# EAGLE design RGB (EAGLE 9.5.0)
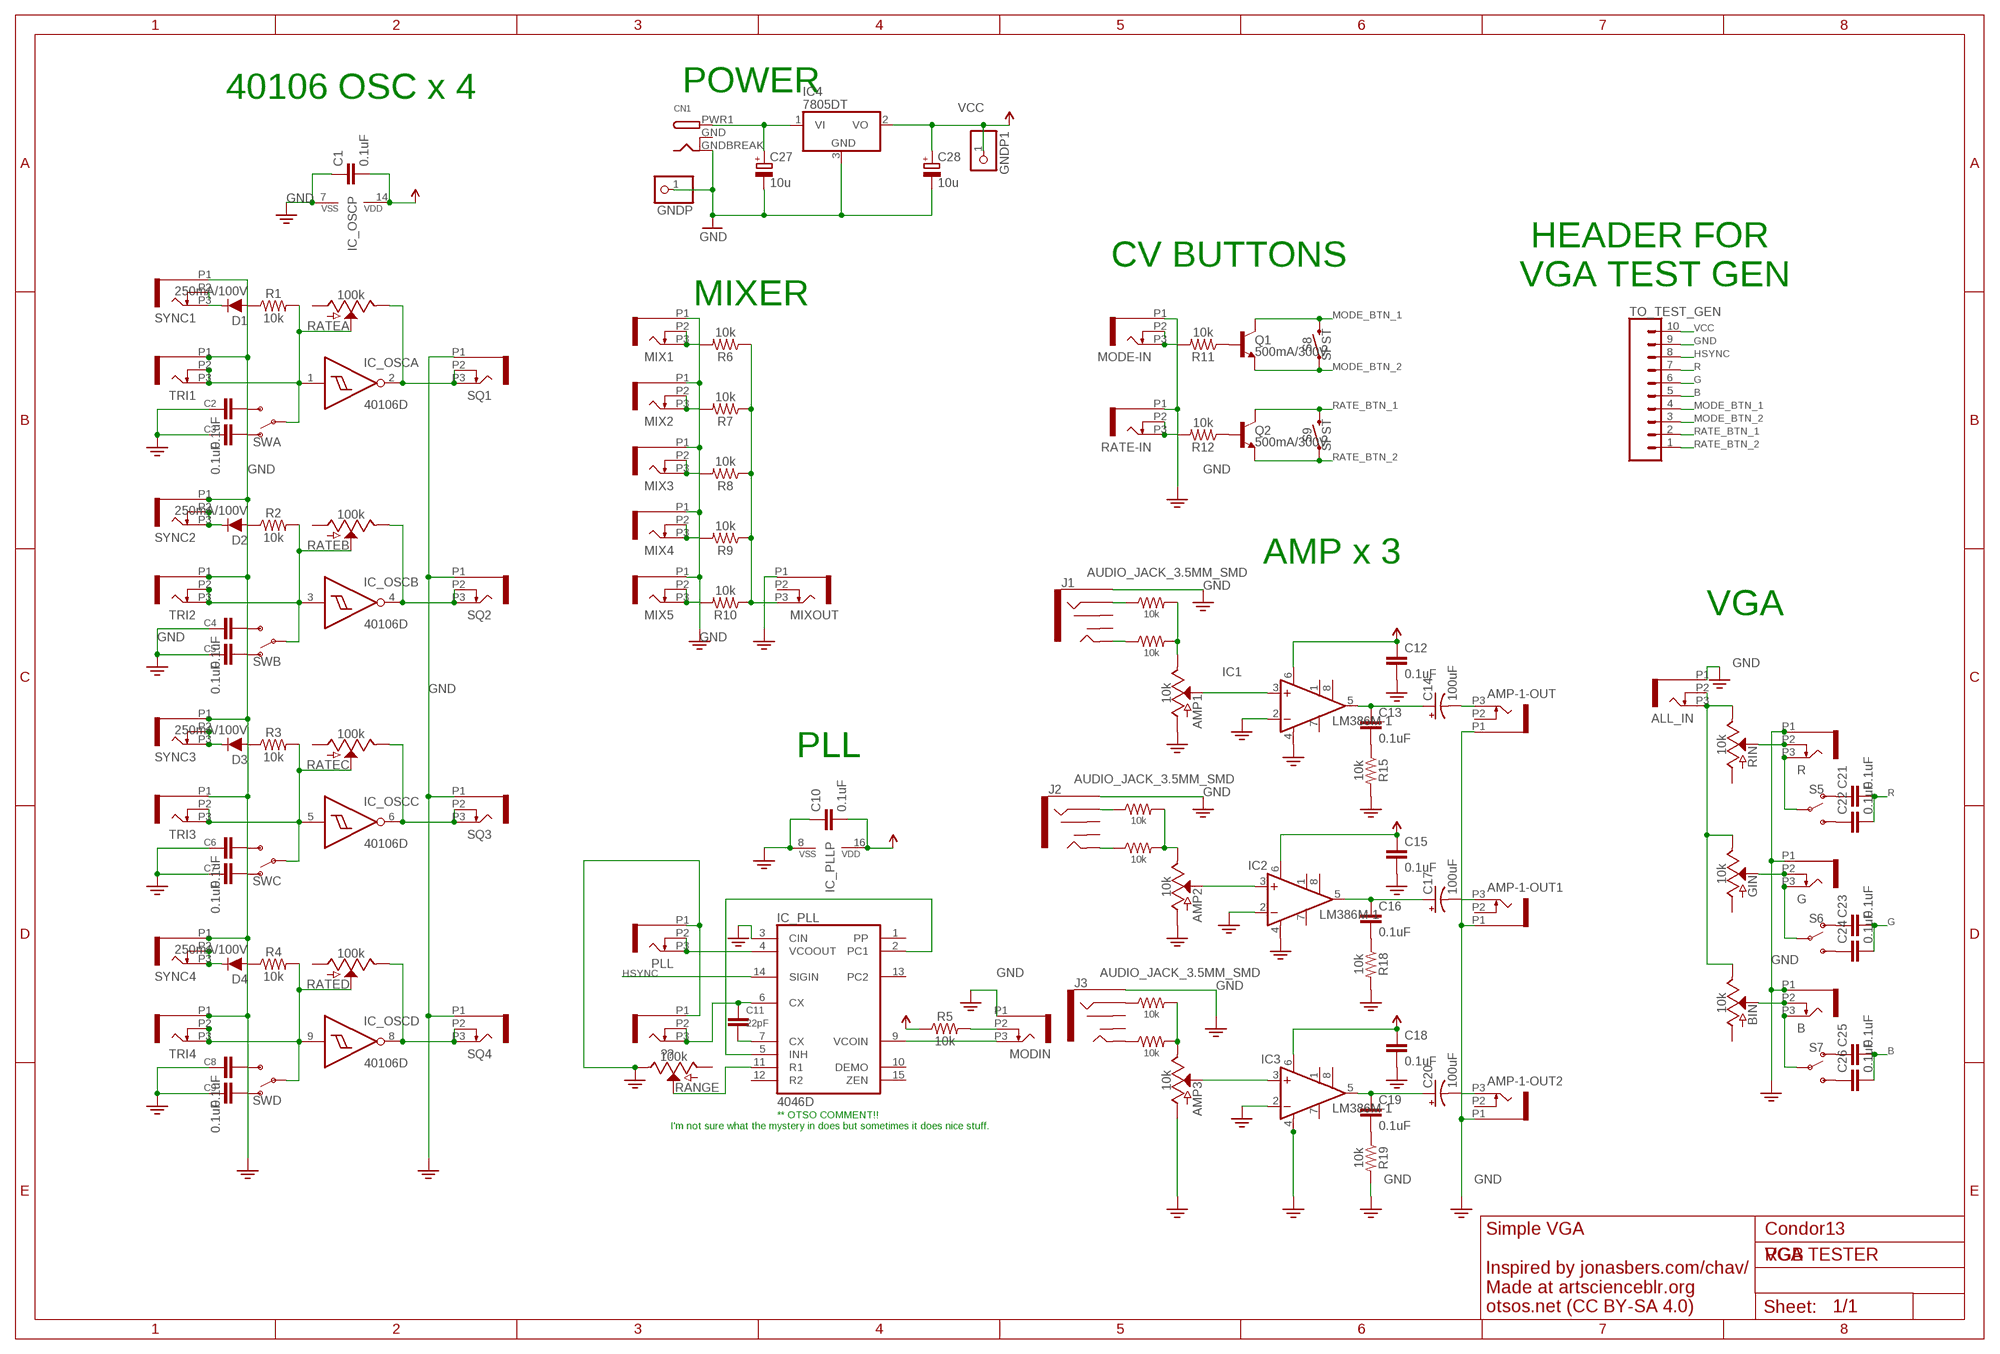
[diagram p0: schematic, sheet 1]

## Parts
??  PJ301_THONKICONN6  [WQP_PJ_301M6]
ALL_IN  PJ301_THONKICONN6  [WQP_PJ_301M6]
AMP1  10k  POTENTIOMETER-PTH-9MM-1/20W-20%-KIT  [POT-PTH-ALPS-KIT]
AMP2  10k  POTENTIOMETER-PTH-9MM-1/20W-20%-KIT  [POT-PTH-ALPS-KIT]
AMP3  10k  POTENTIOMETER-PTH-9MM-1/20W-20%-KIT  [POT-PTH-ALPS-KIT]
AMP-1-OUT  PJ301_THONKICONN6  [WQP_PJ_301M6]
AMP-1-OUT1  PJ301_THONKICONN6  [WQP_PJ_301M6]
AMP-1-OUT2  PJ301_THONKICONN6  [WQP_PJ_301M6]
B  PJ301_THONKICONN6  [WQP_PJ_301M6]
BIN  10k  POTENTIOMETER-PTH-9MM-1/20W-20%-KIT  [POT-PTH-ALPS-KIT]
C1  0.1uF  0.1UF-0603-25V-5%  [0603]
C2  0.1uF  0.1UF-0603-25V-5%  [0603]
C3  0.1uF  0.1UF-0603-25V-5%  [0603]
C4  0.1uF  0.1UF-0603-25V-5%  [0603]
C5  0.1uF  0.1UF-0603-25V-5%  [0603]
C6  0.1uF  0.1UF-0603-25V-5%  [0603]
C7  0.1uF  0.1UF-0603-25V-5%  [0603]
C8  0.1uF  0.1UF-0603-25V-5%  [0603]
C9  0.1uF  0.1UF-0603-25V-5%  [0603]
C10  0.1uF  0.1UF-0603-25V-5%  [0603]
C11  22pF  22PF-0603-50V-5%  [0603]
C12  0.1uF  0.1UF-0603-25V-5%  [0603]
C13  0.1uF  0.1UF-0603-25V-5%  [0603]
C14  100uF  100UF-POLAR-25V-20%(ELEC)  [PANASONIC_D]
C15  0.1uF  0.1UF-0603-25V-5%  [0603]
C16  0.1uF  0.1UF-0603-25V-5%  [0603]
C17  100uF  100UF-POLAR-25V-20%(ELEC)  [PANASONIC_D]
C18  0.1uF  0.1UF-0603-25V-5%  [0603]
C19  0.1uF  0.1UF-0603-25V-5%  [0603]
C20  100uF  100UF-POLAR-25V-20%(ELEC)  [PANASONIC_D]
C21  0.1uF  0.1UF-0603-25V-5%  [0603]
C22  0.1uF  0.1UF-0603-25V-5%  [0603]
C23  0.1uF  0.1UF-0603-25V-5%  [0603]
C24  0.1uF  0.1UF-0603-25V-5%  [0603]
C25  0.1uF  0.1UF-0603-25V-5%  [0603]
C26  0.1uF  0.1UF-0603-25V-5%  [0603]
C27  10u  CPOL-EUD  [PANASONIC_D]
C28  10u  CPOL-EUD  [PANASONIC_D]
CN1  DCBARRELSMT  [DCJACK_2MM_SMT]
D1  250mA/100V  DIODE-BAS16J  [SOD-323]
D2  250mA/100V  DIODE-BAS16J  [SOD-323]
D3  250mA/100V  DIODE-BAS16J  [SOD-323]
D4  250mA/100V  DIODE-BAS16J  [SOD-323]
G  PJ301_THONKICONN6  [WQP_PJ_301M6]
GIN  10k  POTENTIOMETER-PTH-9MM-1/20W-20%-KIT  [POT-PTH-ALPS-KIT]
GNDP  PINHD-1X1CB  [1X01-CLEANBIG]
GNDP1  PINHD-1X1CB  [1X01-CLEANBIG]
IC1  LM386M-1  [SO08]
IC2  LM386M-1  [SO08]
IC3  LM386M-1  [SO08]
IC4  7805DT  [TO252]
IC_OSC  40106D  [SO14]
IC_PLL  4046D  [SO16]
J1  AUDIO_JACK_3.5MM_SMD  [AUDIO-JACK-3.5MM-SMD]
J2  AUDIO_JACK_3.5MM_SMD  [AUDIO-JACK-3.5MM-SMD]
J3  AUDIO_JACK_3.5MM_SMD  [AUDIO-JACK-3.5MM-SMD]
MIX1  PJ301_THONKICONN6  [WQP_PJ_301M6]
MIX2  PJ301_THONKICONN6  [WQP_PJ_301M6]
MIX3  PJ301_THONKICONN6  [WQP_PJ_301M6]
MIX4  PJ301_THONKICONN6  [WQP_PJ_301M6]
MIX5  PJ301_THONKICONN6  [WQP_PJ_301M6]
MIXOUT  PJ301_THONKICONN6  [WQP_PJ_301M6]
MODE-IN  PJ301_THONKICONN6  [WQP_PJ_301M6]
MODIN  PJ301_THONKICONN6  [WQP_PJ_301M6]
PLL  PJ301_THONKICONN6  [WQP_PJ_301M6]
Q1  500mA/300V  TRANS_NPN-MMBTA42  [SOT23-3]
Q2  500mA/300V  TRANS_NPN-MMBTA42  [SOT23-3]
R  PJ301_THONKICONN6  [WQP_PJ_301M6]
R1  10k  10KOHM-0603-1/10W-1%  [0603]
R2  10k  10KOHM-0603-1/10W-1%  [0603]
R3  10k  10KOHM-0603-1/10W-1%  [0603]
R4  10k  10KOHM-0603-1/10W-1%  [0603]
R5  10k  10KOHM-0603-1/10W-1%  [0603]
R6  10k  10KOHM-0603-1/10W-1%  [0603]
R7  10k  10KOHM-0603-1/10W-1%  [0603]
R8  10k  10KOHM-0603-1/10W-1%  [0603]
R9  10k  10KOHM-0603-1/10W-1%  [0603]
R10  10k  10KOHM-0603-1/10W-1%  [0603]
R11  10k  10KOHM-0603-1/10W-1%  [0603]
R12  10k  10KOHM-0603-1/10W-1%  [0603]
R13  10k  10KOHM-0603-1/10W-1%  [0603]
R14  10k  10KOHM-0603-1/10W-1%  [0603]
R15  10k  10KOHM-0603-1/10W-1%  [0603]
R16  10k  10KOHM-0603-1/10W-1%  [0603]
R17  10k  10KOHM-0603-1/10W-1%  [0603]
R18  10k  10KOHM-0603-1/10W-1%  [0603]
R19  10k  10KOHM-0603-1/10W-1%  [0603]
R20  10k  10KOHM-0603-1/10W-1%  [0603]
R21  10k  10KOHM-0603-1/10W-1%  [0603]
RANGE  100k  POTENTIOMETER-PTH-9MM-1/20W-20%-KIT  [POT-PTH-ALPS-KIT]
RATE-IN  PJ301_THONKICONN6  [WQP_PJ_301M6]
RATEA  100k  POTENTIOMETER-PTH-9MM-1/20W-20%-KIT  [POT-PTH-ALPS-KIT]
RATEB  100k  POTENTIOMETER-PTH-9MM-1/20W-20%-KIT  [POT-PTH-ALPS-KIT]
RATEC  100k  POTENTIOMETER-PTH-9MM-1/20W-20%-KIT  [POT-PTH-ALPS-KIT]
RATED  100k  POTENTIOMETER-PTH-9MM-1/20W-20%-KIT  [POT-PTH-ALPS-KIT]
RIN  10k  POTENTIOMETER-PTH-9MM-1/20W-20%-KIT  [POT-PTH-ALPS-KIT]
S5  SWITCH-SPDT-PTH-11.6X4.0MM-LOCK  [SWITCH_SPDT_PTH_11.6X4.0MM_LOCK]
S6  SWITCH-SPDT-PTH-11.6X4.0MM-LOCK  [SWITCH_SPDT_PTH_11.6X4.0MM_LOCK]
S7  SWITCH-SPDT-PTH-11.6X4.0MM-LOCK  [SWITCH_SPDT_PTH_11.6X4.0MM_LOCK]
S8  SPST  MOMENTARY-SWITCH-SPST-SMD-6.2MM-TALL  [TACTILE_SWITCH_SMD_6.2MM_TALL]
S9  SPST  MOMENTARY-SWITCH-SPST-SMD-6.2MM-TALL  [TACTILE_SWITCH_SMD_6.2MM_TALL]
SQ1  PJ301_THONKICONN6  [WQP_PJ_301M6]
SQ2  PJ301_THONKICONN6  [WQP_PJ_301M6]
SQ3  PJ301_THONKICONN6  [WQP_PJ_301M6]
SQ4  PJ301_THONKICONN6  [WQP_PJ_301M6]
SWA  SWITCH-SPDT-PTH-11.6X4.0MM-LOCK  [SWITCH_SPDT_PTH_11.6X4.0MM_LOCK]
SWB  SWITCH-SPDT-PTH-11.6X4.0MM-LOCK  [SWITCH_SPDT_PTH_11.6X4.0MM_LOCK]
SWC  SWITCH-SPDT-PTH-11.6X4.0MM-LOCK  [SWITCH_SPDT_PTH_11.6X4.0MM_LOCK]
SWD  SWITCH-SPDT-PTH-11.6X4.0MM-LOCK  [SWITCH_SPDT_PTH_11.6X4.0MM_LOCK]
SYNC1  PJ301_THONKICONN6  [WQP_PJ_301M6]
SYNC2  PJ301_THONKICONN6  [WQP_PJ_301M6]
SYNC3  PJ301_THONKICONN6  [WQP_PJ_301M6]
SYNC4  PJ301_THONKICONN6  [WQP_PJ_301M6]
TO_TEST_GEN  CONN_102MMSMD  [1X10-2MM-SMD]
TRI1  PJ301_THONKICONN6  [WQP_PJ_301M6]
TRI2  PJ301_THONKICONN6  [WQP_PJ_301M6]
TRI3  PJ301_THONKICONN6  [WQP_PJ_301M6]
TRI4  PJ301_THONKICONN6  [WQP_PJ_301M6]

## Nets
3.3V: IC2.4(GND) ; supply symbol labelled GND
B: C25.2 C26.2 TO_TEST_GEN.5
G: C23.2 C24.2 TO_TEST_GEN.6
GND: ??.P1 ALL_IN.P1 AMP1.P$3(A) AMP2.P$3(A) AMP3.P$3(A) AMP-1-OUT1.P1 AMP-1-OUT2.P1 AMP-1-OUT.P1 B.P1 C1.1 C2.2 C3.2 C4.2 C5.2 C6.2 C7.2 C8.2 C9.2 C10.1 C12.2 C15.2 C18.2 C27.- C28.- CN1.GNDBREAK(GND) G.P1 GNDP.1 IC1.2(-IN) IC1.4(GND) IC2.2(-IN) IC3.2(-IN) IC3.4(GND) IC4.3(GND) IC_OSC.7(P:VSS) IC_PLL.3(CIN) IC_PLL.8(VSS) J1.SLEEVE J2.SLEEVE J3.SLEEVE MIX1.P1 MIX2.P1 MIX3.P1 MIX4.P1 MIX5.P1 MIXOUT.P1 MODE-IN.P1 MODIN.P1 PLL.P1 R15.2 R18.2 R19.2 R.P1 RANGE.P$1(E) RATE-IN.P1 SQ1.P1 SQ2.P1 SQ3.P1 SQ4.P1 SYNC1.P1 SYNC2.P1 SYNC3.P1 SYNC4.P1 TO_TEST_GEN.9 TRI1.P1 TRI2.P1 TRI3.P1 TRI4.P1
HSYNC: IC_PLL.14(SIGIN) TO_TEST_GEN.8
MODE_BTN_1: Q1.3(C) S8.B2 TO_TEST_GEN.4
MODE_BTN_2: Q1.2(E) S8.A2 TO_TEST_GEN.3
N$1: IC_PLL.2(PC1) IC_PLL.5(INH)
N$2: ??.P2 ??.P3 C11.1 IC_PLL.6(CX)
N$3: C11.2 IC_PLL.7(CX)
N$4: MIX1.P2 MIX1.P3 R6.2
N$5: MIX2.P2 MIX2.P3 R7.2
N$6: MIX3.P2 MIX3.P3 R8.2
N$7: MIX4.P2 MIX4.P3 R9.2
N$8: AMP1.P$2(S) IC1.3(+IN)
N$9: C13.2 R15.1
N$10: MIX5.P2 MIX5.P3 R10.2
N$11: MIXOUT.P3 R6.1 R7.1 R8.1 R9.1 R10.1
N$12: C13.1 C14.+ IC1.5(OUT)
N$13: ALL_IN.P3 BIN.P$1(E) GIN.P$1(E) RIN.P$1(E)
N$14: D2.A R2.1
N$15: R.P2 RIN.P$2(S)
N$16: R.P3 S5.2(P)
N$17: IC_OSC.2(A:O) RATEA.P$1(E) SQ1.P2 SQ1.P3
N$18: D2.C SYNC2.P3
N$19: IC_OSC.4(B:O) RATEB.P$1(E) SQ2.P2 SQ2.P3
N$20: SYNC3.P2
N$21: C4.1 SWB.3(S)
N$22: C22.1 S5.3(S)
N$23: C21.1 S5.1(O)
N$24: G.P2 GIN.P$2(S)
N$25: G.P3 S6.2(P)
N$26: C24.1 S6.3(S)
N$27: C23.1 S6.1(O)
N$28: AMP1.P$1(E) R13.2 R14.2
N$29: D1.C SYNC1.P3
N$30: D1.A R1.1
N$31: IC_OSC.1(A:I) R1.2 RATEA.P$2(S) SWA.2(P) TRI1.P2 TRI1.P3
N$32: C2.1 SWA.3(S)
N$33: C3.1 SWA.1(O)
N$34: C5.1 SWB.1(O)
N$35: D3.A R3.1
N$36: D3.C SYNC3.P3
N$37: IC_OSC.6(C:O) RATEC.P$1(E) SQ3.P2 SQ3.P3
N$38: IC_OSC.5(C:I) R3.2 RATEC.P$2(S) SWC.2(P) TRI3.P2 TRI3.P3
N$39: C6.1 SWC.3(S)
N$40: C7.1 SWC.1(O)
N$41: D4.A R4.1
N$42: D4.C SYNC4.P3
N$43: IC_OSC.8(D:O) RATED.P$1(E) SQ4.P2 SQ4.P3
N$44: IC_OSC.9(D:I) R4.2 RATED.P$2(S) SWD.2(P) TRI4.P2 TRI4.P3
N$45: C8.1 SWD.3(S)
N$46: C9.1 SWD.1(O)
N$47: IC_PLL.11(R1) RANGE.P$2(S)
N$48: MODIN.P2 R5.2
N$49: IC_PLL.9(VCOIN) MODIN.P3
N$50: J1.RING R13.1
N$51: J1.TIP R14.1
N$52: AMP-1-OUT.P3 C14.-
N$53: AMP2.P$2(S) IC2.3(+IN)
N$54: C16.2 R18.1
N$55: C16.1 C17.+ IC2.5(OUT)
N$56: J2.RING R16.1
N$57: J2.TIP R17.1
N$58: AMP2.P$1(E) R16.2 R17.2
N$59: AMP-1-OUT1.P3 C17.-
N$60: AMP3.P$2(S) IC3.3(+IN)
N$61: C19.2 R19.1
N$62: C19.1 C20.+ IC3.5(OUT)
N$63: B.P2 BIN.P$2(S)
N$64: B.P3 S7.2(P)
N$65: J3.RING R20.1
N$66: AMP-1-OUT2.P3 C20.-
N$67: C26.1 S7.3(S)
N$68: C25.1 S7.1(O)
N$69: Q1.1(B) R11.1
N$70: MODE-IN.P3 R11.2
N$71: Q2.1(B) R12.1
N$72: R12.2 RATE-IN.P3
N$73: AMP3.P$1(E) R20.2 R21.2
N$74: J3.TIP R21.1
N$75: SYNC4.P2
N$76: SYNC1.P2
N$77: SYNC2.P2
N$78: IC_OSC.3(B:I) R2.2 RATEB.P$2(S) SWB.2(P) TRI2.P2 TRI2.P3
N$79: C27.+ CN1.PWR1(PWR) IC4.1(VI)
N$87: IC_PLL.4(VCOOUT) PLL.P2 PLL.P3
N$88: MODE-IN.P2
N$89: RATE-IN.P2
N$90: ALL_IN.P2
R: C21.2 C22.2 TO_TEST_GEN.7
RATE_BTN_1: Q2.3(C) S9.B2 TO_TEST_GEN.2
RATE_BTN_2: Q2.2(E) S9.A2 TO_TEST_GEN.1
VCC: C1.2 C10.2 C12.1 C15.1 C18.1 C28.+ GNDP1.1 IC1.6(VS) IC2.6(VS) IC3.6(VS) IC4.2(VO) IC_OSC.14(P:VDD) IC_PLL.16(VDD) R5.1 TO_TEST_GEN.10
Unconnected: AMP-1-OUT1.P2 AMP-1-OUT2.P2 AMP-1-OUT.P2 BIN.P$3(A) GIN.P$3(A) IC1.1(GAIN) IC1.7(BYPASS) IC1.8(GAIN) IC2.1(GAIN) IC2.7(BYPASS) IC2.8(GAIN) IC3.1(GAIN) IC3.7(BYPASS) IC3.8(GAIN) IC_OSC.10(E:O) IC_OSC.11(E:I) IC_OSC.12(F:O) IC_OSC.13(F:I) IC_PLL.1(PP) IC_PLL.10(DEMO) IC_PLL.12(R2) IC_PLL.13(PC2) IC_PLL.15(ZEN) J1.RSH J1.TSH J2.RSH J2.TSH J3.RSH J3.TSH MIXOUT.P2 RANGE.P$3(A) RATEA.P$3(A) RATEB.P$3(A) RATEC.P$3(A) RATED.P$3(A) RIN.P$3(A)

## Notes on the sheet
- 40106 OSC x 4
- POWER
- CV BUTTONS
- HEADER FOR 
  VGA TEST GEN
- MIXER
- AMP x 3
- VGA
- PLL
- ** OTSO COMMENT!! 
  I'm not sure what the mystery in does but sometimes it does nice stuff.
- Simple VGA 
  
  Inspired by jonasbers.com/chav/
  Made at artscienceblr.org
  otsos.net (CC BY-SA 4.0)
- Condor13
- VGA TESTER

## Power pins joined to a net without a drawn wire
GNDBREAK: CN1.GND(GNDBREAK)

## Library data of the parts
?? ALL_IN AMP-1-OUT AMP-1-OUT1 AMP-1-OUT2 B G MIX1-MIX5 MIXOUT MODE-IN MODIN PLL R RATE-IN SQ1-SQ4 SYNC1-SYNC4 TRI1-TRI4 = og-pj301:PJ301_THONKICONN
AMP1-AMP3 BIN GIN RIN = SparkFun-Resistors:POTENTIOMETER: Potentiometer (Pot) Three-terminal potentiometers, with an adjustable wiper and two adjustable resistors. A pot can be used to create a configurable voltage divider, or as a variable resistor. Variants ALPS_POT and ALPS_POT_KIT - PTH, breadboard compatible, 9mm square pots Rotary Potentiometer - Linear (10k ohm) <https://www.sparkfun.com/products/9288> (COM-09288) The KIT variant exposes copper on only one side of the PTH pad, so the part can only be assembled on one side of the PCB. Useful for beginner soldering kits.; PROD_ID: RES-09177; SF_SKU: COM-09288
C1-C10 C12 C13 C15 C16 C18 C19 C21-C26 = SparkFun-Capacitors:0.1UF: 0.1µF ceramic capacitors A capacitor is a passive two-terminal electrical component used to store electrical energy temporarily in an electric field.; PROD_ID: CAP-08604
C11 = SparkFun-Capacitors:22PF: 22pF ceramic capacitors A capacitor is a passive two-terminal electrical component used to store electrical energy temporarily in an electric field.; PROD_ID: CAP-07876
C14 C17 C20 = SparkFun-Capacitors:100UF-POLAR: 100µF polarized capacitors A capacitor is a passive two-terminal electrical component used to store electrical energy temporarily in an electric field.; PROD_ID: CAP-12547
C27 C28 = rcl:CPOL-EU: POLARIZED CAPACITOR, European symbol
CN1 = adafruit:DCBARREL: 2.0mm DC Barrel Jack DCJACK_2MM_PTH - Through Hole Jack (4UConnector: 05537)
D1-D4 = SparkFun-DiscreteSemi:DIODE: Diode These are standard reverse protection diodes and small signal diodes. SparkFun Products: SparkFun SparkPunk Sound Kit <https://www.sparkfun.com/products/11177> SparkFun ESP8266 Thing <https://www.sparkfun.com/products/13231>; PROD_ID: DIO-09646
GNDP GNDP1 = adafruit:PINHD-1X1: Pin header 1x1 for 0.1" spacing With round pins
IC1-IC3 = linear:LM386?-*: Low Voltage Audio Power Amplifier Source: http://cache.national.com/ds/LM/LM386.pdf
IC4 = adafruit:78*: Positive VOLTAGE REGULATOR Added bigger pads to the TO-92 package
IC_OSC = 40xx:40106: Hex SCHMITT TRIGGER
IC_PLL = 40xx:4046: Micropower PLL
J1-J3 = SparkFun-Connectors:AUDIO_JACK_3.5MM: Audio Jack 3.5mm variants of PTH and SMT stereo audio jack with bypass switches. SparkFun Products: SparkFun SparkPunk Sound Kit <[https://www.sparkfun.com/products/11177]> - PTH MP3 Trigger <https://www.sparkfun.com/products/13720> -3.5mm SMD SparkFun PicoBoard <https://www.sparkfun.com/products/11888>- 2.5mm SMD; PROD_ID: CONN-10353
Q1 Q2 = SparkFun-DiscreteSemi:TRANS_NPN: NPN transistor Current controlled devices typically used to amplify current or used as a switch. BC547 - COM-08928 <http://www.sparkfun.com/products/8928> (TO-92 45V 100mA) (1.Collector 2.Base 3.Emitter) 2N3904 - COM-00521 <http://www.sparkfun.com/products/521> (TO-92 40V 200mA) (1.Emitter 2.Base 3.Collector) P2N2222A - COM-12852 <http://www.sparkfun.com/products/12852> (TO-92 40V 600mA) (1.Collector 2.Base 3.Emitter); PROD_ID: TRANS-09116
R1-R21 = SparkFun-Resistors:10KOHM: 10kΩ resistor A resistor is a passive two-terminal electrical component that implements electrical resistance as a circuit element. Resistors act to reduce current flow, and, at the same time, act to lower voltage levels within circuits. - Wikipedia; PROD_ID: RES-00824
RANGE RATEA RATEB RATEC RATED = SparkFun-Resistors:POTENTIOMETER: Potentiometer (Pot) Three-terminal potentiometers, with an adjustable wiper and two adjustable resistors. A pot can be used to create a configurable voltage divider, or as a variable resistor. Variants ALPS_POT and ALPS_POT_KIT - PTH, breadboard compatible, 9mm square pots Rotary Potentiometer - Linear (10k ohm) <https://www.sparkfun.com/products/9288> (COM-09288) The KIT variant exposes copper on only one side of the PTH pad, so the part can only be assembled on one side of the PCB. Useful for beginner soldering kits.; PROD_ID: RES-09177; SF_SKU: COM-09288; VALUE: 10k
S5-S7 SWA SWB SWC SWD = SparkFun-Switches:SWITCH-SPDT: Single Pole, Double Throw (SPDT) Switch Single-pole, double-throw (SPDT) switch. Variant Overview SMD-AYZ0202 Surface Mount DPDT Switch <https://www.sparkfun.com/products/597> (COM-00597) Used on e.g. LilyPad Arduino USB - ATmega32U4 Board <https://www.sparkfun.com/products/12049> PTH-11.6X4.0MM SPDT Mini Power Switch <https://www.sparkfun.com/products/102> (COM-00102) Used on e.g. SparkFun Simon Says - Through-Hole Soldering Kit <https://www.sparkfun.com/products/10547> (KIT-10547) PTH-11.6X4.0MM-KIT KIT version of SPDT Mini Power Switch - Simplifies soldering by removing tStop of switch pins - only one side can be soldered. PTH-11.6X4.0MM-LOCK LOCK version of SPDT Mini Power Switch - Offset pins hold switch in place for easier soldering. SMD-RIGHT-ANGLE Surface Mount Right Angle Switch <https://www.sparkfun.com/products/10860> (COM-10860) Used on e.g. SparkFun ESP8266 Thing <https://www.sparkfun.com/products/13231>; PROD_ID: SWCH-08261; SF_SKU: COM-00102
S8 S9 = SparkFun-Switches:MOMENTARY-SWITCH-SPST: Momentary Switch (Pushbutton) - SPST Normally-open (NO) SPST momentary switches (buttons, pushbuttons). Variants PTH-12MM - 12mm square, through-hole Momentary Pushbutton Switch - 12mm Square <https://www.sparkfun.com/products/9190> (COM-09190) PTH-6.0MM, PTH-6.0MM-KIT - 6.0mm square, through-hole Mini Pushbutton Switch <https://www.sparkfun.com/products/97> (COM-00097) KIT package intended for soldering kit's - only one side of pads' copper is exposed. PTH-RIGHT-ANGLE-KIT - Right-angle, through-hole Right Angle Tactile Button <https://www.sparkfun.com/products/10791> - Used on SparkFun BigTime Watch Kit <https://www.sparkfun.com/products/11734> SMD-12MM - 12mm square, surface-mount Tactile Button - SMD (12mm) <https://www.sparkfun.com/products/12993> (COM-12993) Used on SparkFun PicoBoard <https://www.sparkfun.com/products/11888> SMD-4.5MM - 4.5mm Square Trackball Switch Used on SparkFun Blackberry Trackballer Breakout <https://www.sparkfun.com/products/13169> SMD-4.6MMX2.8MM - 4.60mm x 2.80mm, surface mount Used on SparkFun SAMD21 Mini Breakout <https://www.sparkfun.com/products/13664> SMD-5.2MM, SMD-5.2-REDUNDANT - 5.2mm square, surface-mount Mini Pushbutton Switch - SMD <https://www.sparkfun.com/products/8720> (COM-08720) Used on Arduino Pro Mini <https://www.sparkfun.com/products/11114> REDUNDANT package connects both switch circuits together SMD-6.0X3.5MM - 6.0 x 3.5mm, surface mount Momentary Reset Switch SMD <https://www.sparkfun.com/products/8229> (COM-08229) SMD-6.2MM-TALL - 6.2mm square, surface mount Tactile Button - SMD (6mm) <https://www.sparkfun.com/products/12992> Used on SparkFun Digital Sandbox <https://www.sparkfun.com/products/12651> SMD-RIGHT-ANGLE - Right-angle, surface mount Used on SparkFun Block for Intel® Edison - Arduino <https://www.sparkfun.com/products/13036>; PROD_ID: SWCH-11966; SF_SKU: COM-12992
TO_TEST_GEN = SparkFun-Connectors:CONN_10: Multi connection point. Often used as Generic Header-pin footprint for 0.1 inch spaced/style header connections On any of the 0.1 inch spaced packages, you can populate with these: Break Away Headers - Straight <https://www.sparkfun.com/products/116> (PRT-00116) Break Away Male Headers - Right Angle <https://www.sparkfun.com/products/553> (PRT-00553) Female Headers <https://www.sparkfun.com/products/115> (PRT-00115) Break Away Headers - Machine Pin <https://www.sparkfun.com/products/117> (PRT-00117) Break Away Female Headers - Swiss Machine Pin <https://www.sparkfun.com/products/743> (PRT-00743) Arduino Stackable Header - 10 Pin <https://www.sparkfun.com/products/11376> (PRT-11376) For SCREWTERMINALS and SPRING TERMINALS visit here: Screw Terimnals on SparkFun.com <https://www.sparkfun.com/search/results?term=Screw+Terminals> (5mm/3.5mm/2.54mm spacing) This device is also useful as a general connection point to wire up your design to another part of your project. Our various solder wires solder well into these plated through hole pads. Hook-Up Wire - Assortment (Stranded, 22 AWG) <https://www.sparkfun.com/products/11375> (PRT-11375) Hook-Up Wire - Assortment (Solid Core, 22 AWG) <https://www.sparkfun.com/products/11367> (PRT-11367) View the entire wire category on our website here <https://www.sparkfun.com/categories/141> Special notes: Molex polarized connector foot print use with SKU : PRT-08231 with associated crimp pins and housings. 1MM SMD Version SKU: PRT-10208 NOTES ON THE VARIANTS LOCK and LOCK_LONGPADS... This footprint was designed to help hold the alignment of a through-hole component (i.e. 6-pin header) while soldering it into place. You may notice that each hole has been shifted either up or down by 0.005 of an inch from it's more standard position (which is a perfectly straight line). This slight alteration caused the pins (the squares in the middle) to touch the edges of the holes. Because they are alternating, it causes a "brace" to hold the component in place. 0.005 has proven to be the perfect amount of "off-center" position when using our standard breakaway headers. Although looks a little odd when you look at the bare footprint, once you have a header in there, the alteration is very hard to notice. Also,if you push a header all the way into place, it is covered up entirely on the bottom side.; PROD_ID: CONN-09042; SF_ID: PRT-10030

## Board
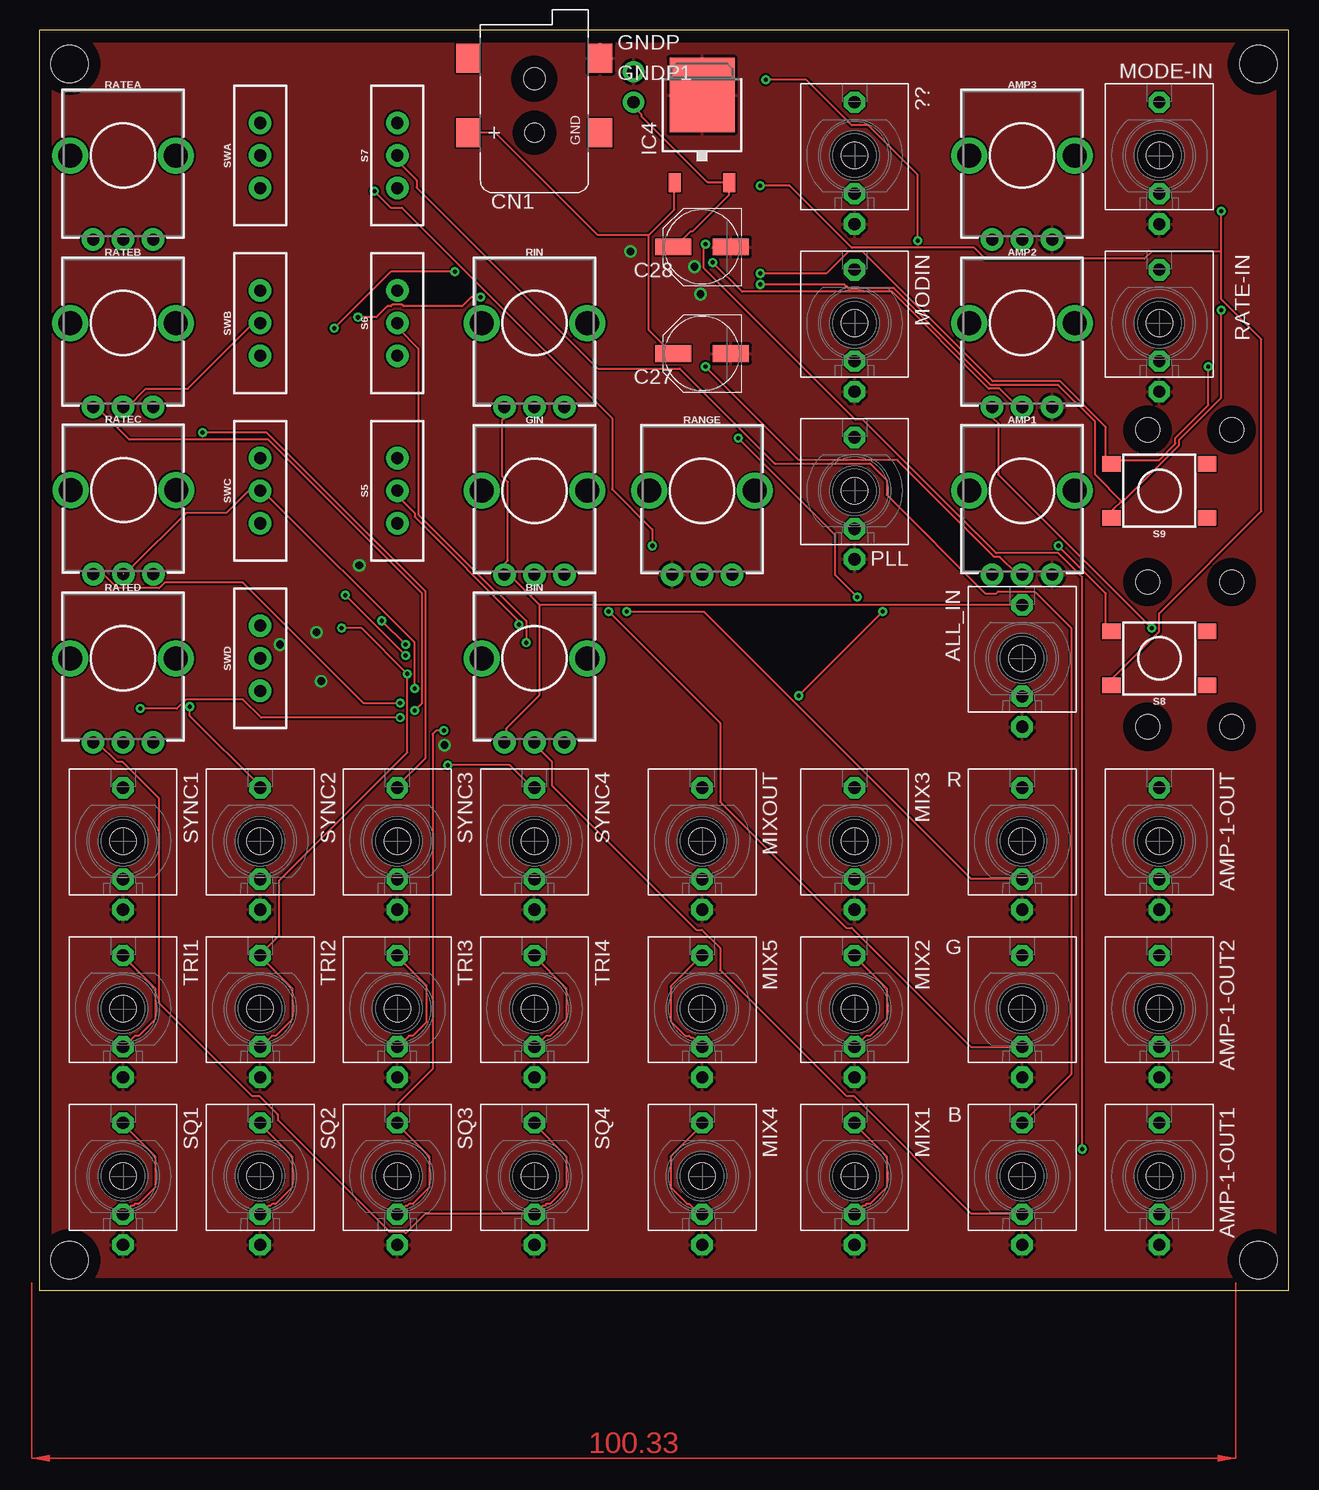
[diagram p1: board, top side]
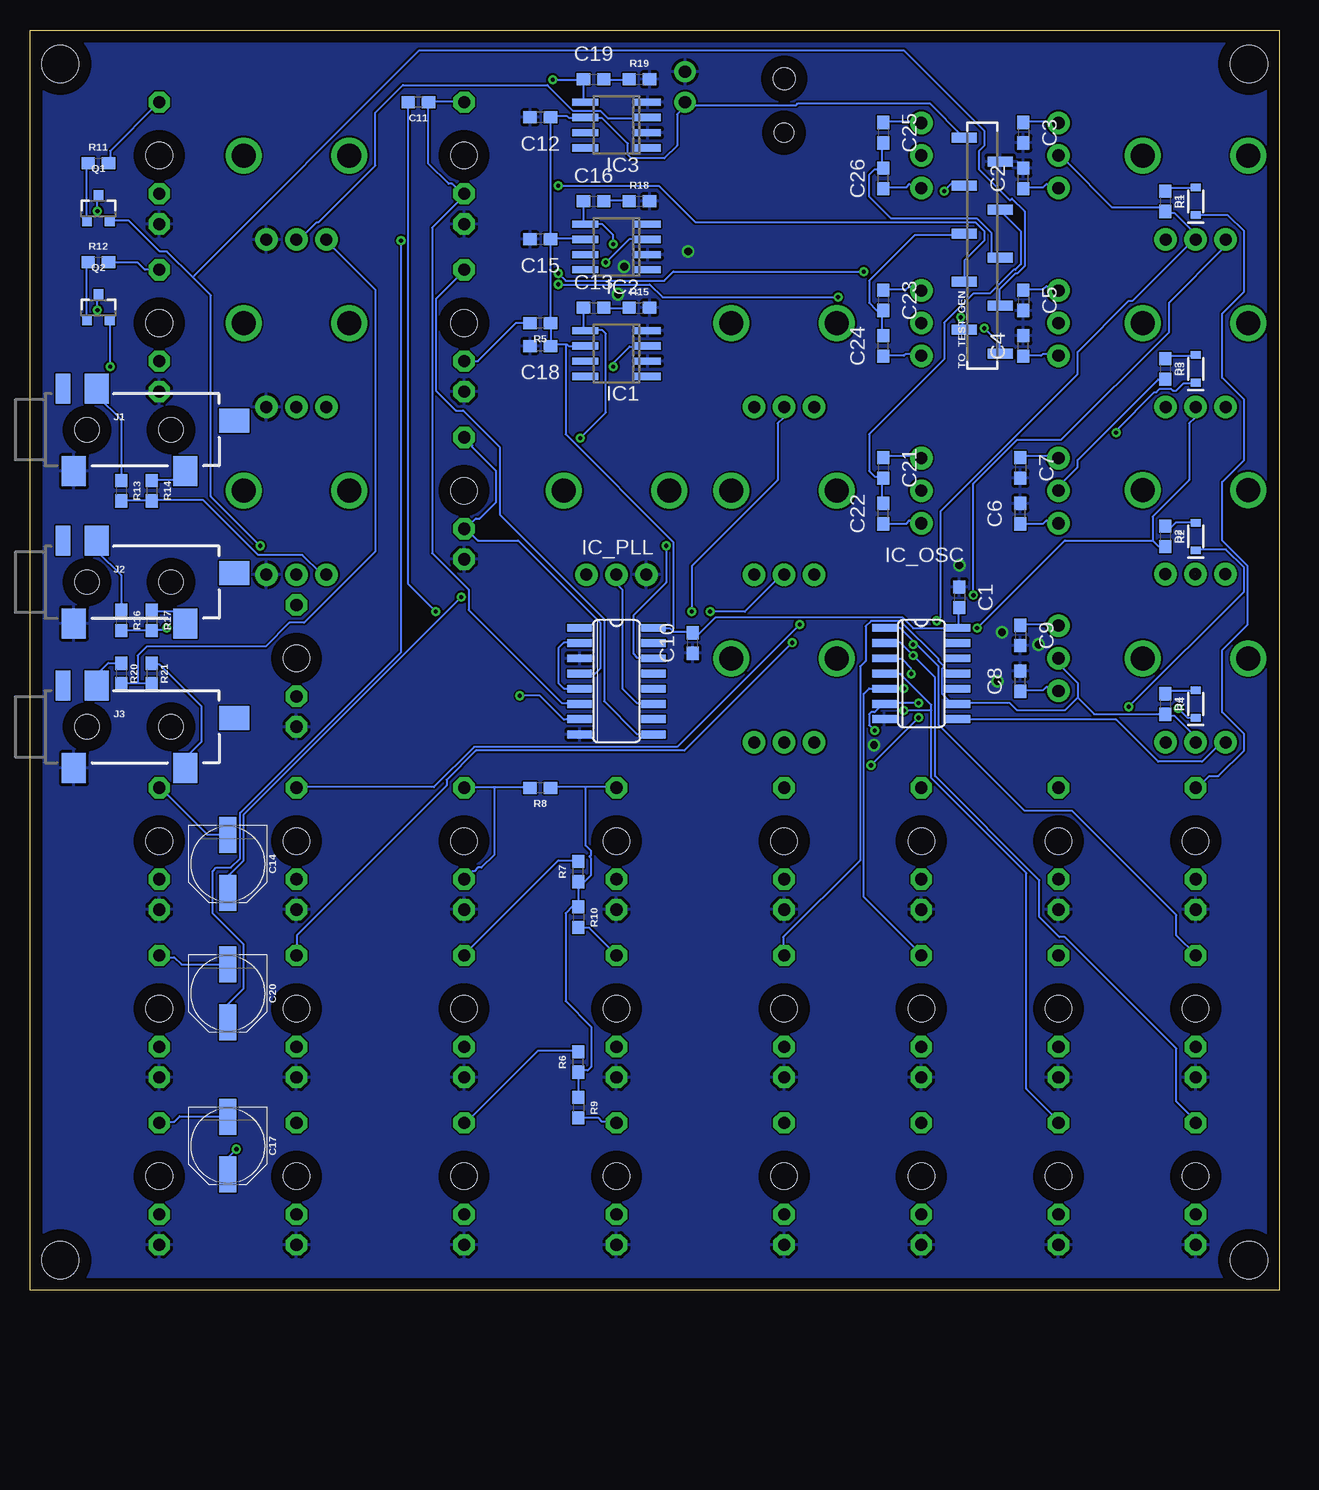
[diagram p2: board, bottom side, seen from below]

Size 104.12 x 105.08 mm. Coordinates in mm from the lower left corner, seen from the top.
Outline: 0,0 104.12,0 104.12,105.08 0,105.08 0,0
Copper layers (1*16): Top 0.035mm / dielectric 1.5mm / Bottom 0.035mm
Design rules "default": minimum track width 6mil, minimum drill 0.35mm, track to track 6mil, track to pad 6mil, pad to pad 6mil, via to via 6mil, smd to smd 6mil, copper to edge 40mil, drill to drill 6mil, minimum pad ring 10mil, minimum via ring 8mil, stop-mask expansion 4mil, vias tented up to drill 0mil, thermal gap 10mil
Holes 3.1 mm at 2.54,2.54 2.54,102.23 101.6,102.23 101.6,2.54

### Footprints (pad centres in the part's own frame; a part is rotated, then mirrored left to right if it is on the bottom)
WQP_PJ_301M6 = drill 1.016 pad 1.778 octagon: P1 0,-5.715; P2 0,-3.175; P3 0,4.445 | hole 2.2: 0,0
POT-PTH-ALPS-KIT = drill 1 pad 1.88: P$1 7,-2.5; P$2 7,0; P$3 7,2.5 | drill 2: P$4 0,-4.4; P$5 0,4.4
0603 = smd 1.1 x 1: 1 -0.85,0; 2 0.85,0
PANASONIC_D = smd 3 x 1.4: + 2.4,0; - -2.4,0
DCJACK_2MM_SMT = smd 2.4 x 2: GND 0,-5.5; GNDBREAK 6.2,-5.5; PWR1 0,5.5; PWR2 6.2,5.5 | hole 1.6: 0,0 | hole 1.8: 4.5,0
SOD-323 = smd 0.63 x 0.83: A 1.15,0; C -1.15,0
1X01-CLEANBIG = drill 1.016 pad 1.778: 1 0,0
SO08 = smd 0.6 x 2.2: 1 -1.905,-2.6; 2 -0.635,-2.6; 3 0.635,-2.6; 4 1.905,-2.6; 5 1.905,2.6; 6 0.635,2.6; 7 -0.635,2.6; 8 -1.905,2.6
TO252 = smd 1 x 1.6: 1 -2.28,-4.8; 2 2.28,-4.8 | smd 5.4 x 6.2: 3 0,2.5
SO14 = smd 0.66 x 2.032: 1 -3.81,-3.073; 2 -2.54,-3.073; 3 -1.27,-3.073; 4 0,-3.073; 5 1.27,-3.073; 6 2.54,-3.073; 7 3.81,-3.073; 8 3.81,3.073; 9 2.54,3.073; 10 1.27,3.073; 11 0,3.073; 12 -1.27,3.073; 13 -2.54,3.073; 14 -3.81,3.073
SO16 = smd 0.66 x 2.032: 1 -4.445,-3.073; 2 -3.175,-3.073; 3 -1.905,-3.073; 4 -0.635,-3.073; 5 0.635,-3.073; 6 1.905,-3.073; 7 3.175,-3.073; 8 4.445,-3.073; 9 4.445,3.073; 10 3.175,3.073; 11 1.905,3.073; 12 0.635,3.073; 13 -0.635,3.073; 14 -1.905,3.073; 15 -3.175,3.073; 16 -4.445,3.073
AUDIO-JACK-3.5MM-SMD = smd 2 x 2.5: RING 4.3,3.45; SLEEVE 2.4,-3.45; TIP 11.7,-3.45 | smd 1.2 x 2.5: RSH 1.5,3.45 | smd 2.5 x 2: TSH 15.75,0.75 | hole 2: 3.5,0; 10.5,0
SOT23-3 = smd 0.8 x 0.9: 1 -0.95,-1; 2 0.95,-1; 3 0,1.1
SWITCH_SPDT_PTH_11.6X4.0MM_LOCK = drill 1.016 pad 1.88: 1 0,2.718; 2 0,0; 3 0,-2.718
TACTILE_SWITCH_SMD_6.2MM_TALL = smd 1.55 x 1.3: A1 -3.975,-2.25; A2 3.975,-2.25; B1 -3.975,2.25; B2 3.975,2.25
1X10-2MM-SMD = smd 0.85 x 2.1: 1 0,-1.5; 2 2,1.5; 3 4,-1.5; 4 6,1.5; 5 8,-1.5; 6 10,1.5; 7 12,-1.5; 8 14,1.5; 9 16,-1.5; 10 18,1.5

### Placement (x,y rotation side)
??  67.94,94.61 0 top
ALL_IN  81.91,52.71 0 top
AMP1  81.91,66.67 270 top
AMP2  81.91,80.64 270 top
AMP3  81.91,94.61 270 top
AMP-1-OUT  93.34,37.47 0 top
AMP-1-OUT1  93.34,9.53 0 top
AMP-1-OUT2  93.34,23.5 0 top
B  81.91,9.53 0 top
BIN  41.28,52.71 270 top
C1  26.67,57.79 270 bottom
C2  21.34,92.71 90 bottom
C3  21.34,96.52 270 bottom
C4  21.34,78.74 90 bottom
C5  21.34,82.55 270 bottom
C6  21.59,64.77 90 bottom
C7  21.59,68.58 270 bottom
C8  21.59,50.8 90 bottom
C9  21.59,54.61 270 bottom
C10  48.9,53.98 90 bottom
C11  71.75,99.06 180 bottom
C12  61.6,97.79 180 bottom
C13  57.15,81.91 0 bottom
C14  87.63,35.56 270 bottom
C15  61.6,87.63 180 bottom
C16  57.15,90.8 0 bottom
C17  87.63,12.06 270 bottom
C18  61.6,78.74 180 bottom
C19  57.15,100.96 0 bottom
C20  87.63,24.77 270 bottom
C21  33.02,68.58 270 bottom
C22  33.02,64.77 90 bottom
C23  33.02,82.55 270 bottom
C24  33.02,78.74 90 bottom
C25  33.02,96.52 270 bottom
C26  33.02,92.71 90 bottom
C27  55.25,78.1 180 top
C28  55.25,86.99 180 top
CN1  41.28,96.52 90 top
D1  6.98,90.8 90 bottom
D2  6.98,62.87 90 bottom
D3  6.98,76.83 90 bottom
D4  6.98,48.9 90 bottom
G  81.91,23.5 0 top
GIN  41.28,66.67 270 top
GNDP  49.53,101.6 0 top
GNDP1  49.53,99.06 0 top
IC1  55.25,78.1 90 bottom
IC2  55.25,86.99 90 bottom
IC3  55.25,97.16 90 bottom
IC4  55.25,97.16 0 top
IC_OSC  29.84,51.44 270 bottom
IC_PLL  55.25,50.8 270 bottom
J1  102.87,71.75 0 bottom
J2  102.87,59.05 0 bottom
J3  102.87,46.99 0 bottom
MIX1  67.94,9.53 0 top
MIX2  67.94,23.5 0 top
MIX3  67.94,37.47 0 top
MIX4  55.25,9.53 0 top
MIX5  55.25,23.5 0 top
MIXOUT  55.25,37.47 0 top
MODE-IN  93.34,94.61 0 top
MODIN  67.94,80.64 0 top
PLL  67.94,66.67 0 top
Q1  98.42,90.17 0 bottom
Q2  98.42,81.91 0 bottom
R  81.91,37.47 0 top
R1  9.53,90.8 270 bottom
R2  9.53,62.87 270 bottom
R3  9.53,76.83 270 bottom
R4  9.53,48.9 270 bottom
R5  61.6,80.64 180 bottom
R6  58.42,19.05 90 bottom
R7  58.42,34.93 90 bottom
R8  61.6,41.91 180 bottom
R9  58.42,15.24 270 bottom
R10  58.42,31.11 270 bottom
R11  98.42,93.98 0 bottom
R12  98.42,85.72 0 bottom
R13  96.52,66.67 270 bottom
R14  93.98,66.67 270 bottom
R15  53.34,81.91 0 bottom
R16  96.52,55.88 270 bottom
R17  93.98,55.88 270 bottom
R18  53.34,90.8 0 bottom
R19  53.34,100.96 0 bottom
R20  96.52,51.44 270 bottom
R21  93.98,51.44 270 bottom
RANGE  55.25,66.67 270 top
RATE-IN  93.34,80.64 0 top
RATEA  6.98,94.61 270 top
RATEB  6.98,80.64 270 top
RATEC  7.01,66.73 270 top
RATED  6.98,52.71 270 top
RIN  41.28,80.64 270 top
S5  29.84,66.67 0 top
S6  29.84,80.64 0 top
S7  29.84,94.61 0 top
S8  93.34,52.71 180 top
S9  93.34,66.67 180 top
SQ1  6.98,9.53 0 top
SQ2  18.41,9.53 0 top
SQ3  29.84,9.53 0 top
SQ4  41.28,9.53 0 top
SWA  18.41,94.61 0 top
SWB  18.41,80.64 0 top
SWC  18.41,66.67 0 top
SWD  18.41,52.71 0 top
SYNC1  6.98,37.47 0 top
SYNC2  18.41,37.47 0 top
SYNC3  29.84,37.47 0 top
SYNC4  41.28,37.47 0 top
TO_TEST_GEN  24.77,78.1 90 bottom
TRI1  6.98,23.5 0 top
TRI2  18.41,23.5 0 top
TRI3  29.84,23.5 0 top
TRI4  41.28,23.5 0 top

### Tracks (layer width: path | path; a pad name or v marks a point on that pad's centre or on a via)
B
  Bottom 0.152: C25.2 33.12,95.61 33.12,93.62 C26.2 33.12,93.47 33.73,93.47 34.19,93.02 34.19,91.19 32.36,89.36 25.2,89.36 23.98,88.14 23.98,86.46 23.67,86.16 23.37,86.16 TO_TEST_GEN.5
G
  Bottom 0.152: C24.2 33.12,79.6 33.12,81.58 C23.2 33.12,81.74 33.58,81.74 34.19,82.35 34.19,84.18 30.38,87.99 26.42,87.99 TO_TEST_GEN.6
GND  (via drill 0.65)
  other vias: 33.78,45.47 23.5,50.8 49.28,86.61 54.61,85.34 55.12,83.06 20.07,53.85 23.11,54.86 26.67,60.45
  pour Top: -3.18,107.95 -3.18,-4.45 108.58,-4.45 108.58,107.95
  pour Bottom: -5.08,111.12 112.39,111.12 112.39,89.53 112.39,-8.89 -8.26,-8.89 -8.26,111.12
HSYNC  (via drill 0.35)
  Top 0.152: v51.11,62.08 51.11,63.45 47.75,66.8 47.75,72.75 30.23,90.27 29.31,90.27 v27.94,91.64
  Bottom 0.152: v51.11,62.08 51.11,59.03 53.85,56.29 53.85,53.09 53.54,52.78 52.17,52.78 IC_PLL.14 | v27.94,91.64 27.33,92.25 26.42,92.25 TO_TEST_GEN.8
MODE_BTN_1  (via drill 0.35)
  Top 0.152: 98.5,86.61 98.5,82.65 101.85,79.3 101.85,64.97 93.32,56.44 93.32,54.92 89.51,51.11 89.51,50.5 S8.B2 | 98.5,86.61 v98.5,89.97 | v60.1,92.1 62.54,92.1 67.72,86.92 77.93,86.92 78.84,86 92.1,86 92.71,86.61 98.5,86.61
  Bottom 0.152: v98.5,89.97 98.5,91.19 Q1.3 | v60.1,92.1 51.71,92.1 48.67,89.05 25.35,89.05 24.59,88.29 24.59,87.53 26.26,85.85 26.26,84.18 TO_TEST_GEN.4
MODE_BTN_2  (via drill 0.35)
  Top 0.152: v84.94,62.08 88.9,58.12 88.9,55.52 89.36,55.07 S8.A2
  Bottom 0.152: 90.58,84.48 89.05,82.96 89.05,66.19 v84.94,62.08 | 90.58,84.48 92.71,86.61 93.32,86.61 95.91,89.2 97.43,89.2 Q1.2 | 90.58,84.48 71.68,103.38 31.29,103.38 24.59,96.67 24.59,95.45 25.04,95 25.04,93.47 22.45,90.88 22.3,91.03 21.23,89.97 21.23,85.39 21.84,84.78 22,84.78 23.37,83.41 23.37,82.19 TO_TEST_GEN.3
N$1
  Bottom 0.152: IC_PLL.5 58.42,50.19 59.64,50.19 60.1,50.65 60.1,53.54 59.64,54 58.42,54 IC_PLL.2
N$2
  Bottom 0.152: ??.P3 68.02,99.11 70.76,99.11 C11.1 70.92,98.96 70.92,93.93 69.24,92.25 68.94,92.25 68.02,91.34 ??.P2 67.87,91.34 70.61,88.59 70.61,61.47 67.56,58.42 67.56,56.74 59.79,48.97 58.42,48.97 IC_PLL.6
N$3  (via drill 0.35)
  Top 0.152: v63.3,49.58 v70.31,56.59
  Bottom 0.152: v70.31,56.59 72.59,58.88 72.59,98.96 C11.2 | v63.3,49.58 61.62,49.58 59.64,47.6 58.42,47.6 IC_PLL.7
N$4
  Top 0.152: MIX1.P2 68.02,6.45 68.63,7.06 68.78,7.06 68.94,7.21 69.24,7.21 70.61,8.59 70.61,11.18 67.87,13.92 MIX1.P3
  Bottom 0.152: R6.2 58.42,20.02 61.77,20.02 67.87,13.92 MIX1.P3
N$5
  Top 0.152: MIX2.P2 68.02,20.32 68.94,21.23 69.24,21.23 70.61,22.61 70.61,25.2 67.87,27.94 MIX2.P3
  Bottom 0.152: R7.2 58.42,35.87 60.1,35.87 68.02,27.94 MIX2.P3
N$6
  Bottom 0.152: 65.43,41.96 67.87,41.96 MIX3.P3 | 65.43,41.96 62.54,41.96 R8.2 | 65.43,41.96 65.43,36.32 66.5,35.26 66.8,35.26 67.11,34.95 67.26,34.95 67.87,34.34 MIX3.P2
N$7
  Top 0.152: MIX4.P2 55.22,6.45 54.92,6.45 54.15,7.21 54,7.21 52.63,8.59 52.63,11.18 55.37,13.92 MIX4.P3
  Bottom 0.152: R9.2 58.42,14.38 56.74,14.38 56.44,14.07 55.37,14.07 MIX4.P3
N$8  (via drill 0.35)
  Top 0.152: v55.52,77.01 63.3,69.24 71.53,69.24 79.6,61.16 80.06,61.16 81.43,59.79 81.89,59.79 AMP1.P$2
  Bottom 0.152: v55.52,77.01 55.52,77.32 54.15,78.69 52.78,78.69 IC1.3
N$9
  Bottom 0.152: R15.1 54.3,81.89 56.29,81.89 C13.2
N$10
  Top 0.152: MIX5.P2 55.22,20.32 54.46,21.08 54.3,21.08 54.15,21.23 53.85,21.23 52.63,22.45 52.63,25.35 55.22,27.94 MIX5.P3
  Bottom 0.152: R10.2 58.42,30.23 57.51,30.23 55.22,27.94 MIX5.P3
N$11
  Bottom 0.152: 57.81,41.96 55.37,41.96 MIXOUT.P3 | 57.81,41.96 60.71,41.96 R8.1 | R9.1 R6.1 58.42,18.34 57.66,18.34 57.35,18.64 57.35,22 59.49,24.13 59.49,31.45 58.88,32.05 58.42,32.05 | 58.42,34.04 58.42,32.05 | 58.42,32.05 R10.1 | 57.81,41.96 57.81,37.08 57.35,36.63 57.35,36.32 57.51,36.17 57.35,36.02 57.35,34.65 57.96,34.04 58.42,34.04 | 58.42,34.04 R7.1
N$12  (via drill 0.35)
  Top 0.152: v58.27,71.07 66.34,62.99 66.34,59.64 v68.17,57.81
  Bottom 0.152: C13.1 57.96,81.89 57.96,80.06 IC1.5 57.81,80.06 56.44,80.06 56.13,79.76 56.13,73.2 v58.27,71.07 | v68.17,57.81 86.31,39.68 86.31,35.87 87.53,34.65 87.53,33.27 C14.+
N$13
  Top 0.152: 41.66,57.2 81.89,57.2 ALL_IN.P3 | 41.66,57.2 39.22,59.64 38.91,59.64 GIN.P$1 38.76,59.79 38.76,60.55 39.07,60.86 39.07,67.41 38.61,67.87 38.61,72.59 38.76,72.75 38.76,73.51 RIN.P$1 | 41.66,57.2 41.66,49.58 38.91,46.84 38.91,45.77 BIN.P$1
N$14
  Bottom 0.152: D2.A 7.06,64.06 8.59,64.06 9.04,63.6 9.5,63.6 R2.1
N$15  (via drill 0.35)
  Top 0.152: v48.97,56.59 55.37,56.59 77.62,34.34 81.89,34.34 R.P2
  Bottom 0.152: v48.97,56.59 48.97,60.4 41.81,67.56 41.81,72.29 41.35,72.75 41.35,73.51 RIN.P$2
N$16  (via drill 0.35)
  Top 0.152: v39.98,55.52 39.98,55.83 31.29,64.52 31.29,64.82 29.92,66.19 29.92,66.65 S5.2
  Bottom 0.152: v39.98,55.52 50.19,45.31 67.11,45.31 70.46,41.96 81.89,41.96 R.P3
N$17  (via drill 0.35)
  Top 0.152: SQ1.P2 7.06,6.45 7.67,7.06 7.82,7.06 7.98,7.21 8.28,7.21 9.65,8.59 9.65,11.18 6.91,13.92 SQ1.P3 | v30.53,52.93 v25.5,57.96
  Bottom 0.152: IC_OSC.2 32.82,54 31.6,54 v30.53,52.93 28.7,51.11 28.7,42.88 20.02,34.19 20.02,31.14 18.34,29.46 17.88,29.46 8.59,20.17 8.59,15.75 6.91,14.07 SQ1.P3 | v25.5,57.96 25.5,67.26 21.84,70.92 18.19,70.92 9.2,79.91 9.2,82.35 4.62,86.92 4.62,87.53 RATEA.P$1
N$18  (via drill 0.35)
  Top 0.152: v12.55,48.67 12.55,47.9 18.49,41.96 SYNC2.P3
  Bottom 0.152: v12.55,48.67 2.95,58.27 2.95,60.25 4.47,61.77 6.91,61.77 D2.C
N$19  (via drill 0.35)
  Top 0.152: SQ2.P2 18.49,6.45 19.1,7.06 19.25,7.06 19.41,7.21 19.71,7.21 21.08,8.59 21.08,11.18 18.34,13.92 SQ2.P3 | v31.29,48.36 31.9,48.97 31.9,58.12 19.1,70.92 7.52,70.92 4.93,73.51 4.62,73.51 RATEB.P$1
  Bottom 0.152: 29.01,48.36 29.01,42.72 21.08,34.8 21.08,16.82 18.34,14.07 SQ2.P3 | 29.01,48.36 29.01,48.82 31.6,51.41 32.82,51.41 IC_OSC.4 | 29.01,48.36 v31.29,48.36
N$21
  Bottom 0.152: C4.1 21.29,77.93 19.86,77.93 19.71,78.08 18.64,78.08 18.49,77.93 SWB.3
N$22
  Bottom 0.152: C22.1 32.97,63.91 31.14,63.91 30.84,64.21 30.68,64.06 29.92,64.06 S5.3
N$23
  Bottom 0.152: C21.1 32.97,69.55 30.07,69.55 29.92,69.39 S5.1
N$24  (via drill 0.35)
  Top 0.152: G.P2 77.62,20.32 67.72,30.23 67.26,30.23 56.74,40.74 56.74,47.3 v47.45,56.59
  Bottom 0.152: v47.45,56.59 44.55,56.59 41.35,59.79 GIN.P$2
N$25  (via drill 0.35)
  Top 0.152: v40.59,54 40.59,55.83 38.15,58.27 38,58.27 31.6,64.67 31.6,78.54 29.92,80.21 29.92,80.52 S6.2
  Bottom 0.152: v40.59,54 49.58,45.01 66.95,45.01 69.39,42.57 69.39,42.11 81.89,29.62 81.89,27.94 G.P3
N$26
  Bottom 0.152: C24.1 32.97,77.93 31.29,77.93 31.14,78.08 30.07,78.08 29.92,77.93 S6.3
N$27
  Bottom 0.152: C23.1 32.97,83.41 31.14,83.41 30.84,83.72 30.53,83.41 29.92,83.41 S6.1
N$28
  Bottom 0.152: R13.2 96.52,65.89 94.08,65.89 R14.2 93.93,65.89 89.66,65.89 85.09,61.32 81.43,61.32 79.91,59.79 79.45,59.79 AMP1.P$1
N$29
  Bottom 0.152: D1.C 6.91,89.66 4.32,89.66 2.95,88.29 2.95,83.26 4.78,81.43 4.78,76.1 2.95,74.27 2.95,69.24 4.78,67.41 4.78,62.54 2.64,60.4 2.64,55.52 4.78,53.39 4.78,48.21 2.95,46.38 2.95,45.01 5.08,42.88 5.84,42.88 6.91,41.81 SYNC1.P3
N$30
  Bottom 0.152: D1.A 7.06,91.95 9.35,91.95 9.5,91.8 R1.1
N$31  (via drill 0.35)
  Top 0.152: TRI1.P2 7.06,20.32 7.98,21.23 8.28,21.23 9.65,22.61 9.65,25.2 6.91,27.94 TRI1.P3 | v30.53,53.85 v28.55,55.83
  Bottom 0.152: SWA.2 17.88,94.08 17.73,94.08 13.92,90.27 9.96,90.27 9.65,89.97 R1.2 9.5,89.81 8.74,89.81 7.06,88.14 7.06,87.68 RATEA.P$2 7.06,87.53 7.52,87.07 7.67,87.07 12.24,82.5 12.55,82.5 16.82,78.23 16.82,76.4 28.25,64.97 28.25,56.13 v28.55,55.83 | 30.38,54 28.4,52.02 28.4,47.14 21.23,39.98 17.27,39.98 8.59,31.29 8.59,29.62 6.91,27.94 TRI1.P3 | 30.38,54 31.6,55.22 32.82,55.22 IC_OSC.1 | 30.38,54 v30.53,53.85
N$32
  Bottom 0.152: C2.1 21.29,91.95 19.71,91.95 19.41,92.25 19.1,91.95 18.49,91.95 SWA.3
N$33
  Bottom 0.152: C3.1 21.29,97.43 18.49,97.43 SWA.1
N$34
  Bottom 0.152: C5.1 21.29,83.41 19.71,83.41 19.41,83.72 19.1,83.41 18.49,83.41 SWB.1
N$35
  Bottom 0.152: D3.A 7.06,77.93 9.35,77.93 9.5,77.77 R3.1
N$36  (via drill 0.35)
  Top 0.152: v13.61,71.53 18.95,71.53 32.21,58.27 32.21,44.4 29.77,41.96 SYNC3.P3
  Bottom 0.152: v13.61,71.53 13.61,71.68 10.41,74.88 10.26,74.88 9.96,75.18 9.04,75.18 8.89,75.03 8.59,75.03 7.98,75.64 7.06,75.64 D3.C
N$37  (via drill 0.35)
  Top 0.152: SQ3.P2 29.92,6.45 30.53,7.06 30.68,7.06 30.84,7.21 31.14,7.21 32.51,8.59 32.51,11.18 29.77,13.92 SQ3.P3 29.92,14.07 29.92,15.6 32.79,18.47 32.79,46.38 33.1,46.69 v33.73,46.69 | v30.07,48.97 27.03,48.97 16.97,59.03 10.47,59.03 9.99,58.56 6.53,58.56 5.36,59.73 RATEC.P$1
  Bottom 0.152: v30.07,48.97 32.82,48.97 IC_OSC.6 32.97,48.97 33.73,48.21 34.04,48.21 34.19,48.06 34.19,47.14 v33.73,46.69
N$38  (via drill 0.35)  (1 unrouted)
  Top 0.152: 7.04,59.74 7.54,60.25 7.67,60.25 12.24,64.82 15.6,64.82 17.42,66.65 18.34,66.65 SWC.2 18.49,66.65 18.95,66.19 19.1,66.19 31.29,54 v31.29,50.19 | TRI3.P2 29.92,20.32 30.84,21.23 31.14,21.23 32.26,22.35 32.26,25.45 29.77,27.94 TRI3.P3
  Bottom 0.152: R3.2 9.65,75.95 10.11,75.95 16.82,69.24 16.82,68.63 18.34,67.11 18.34,66.8 SWC.2 | TRI3.P3 29.77,27.94 34.65,32.82 34.65,49.73 34.19,50.19 32.97,50.19 IC_OSC.5 32.82,50.19 v31.29,50.19
N$39
  Bottom 0.152: C6.1 21.54,63.91 19.71,63.91 19.41,64.21 19.25,64.06 18.49,64.06 SWC.3
N$40
  Bottom 0.152: C7.1 21.54,69.55 18.64,69.55 18.49,69.39 SWC.1
N$41
  Bottom 0.152: D4.A 7.06,50.04 9.35,50.04 9.5,49.89 R4.1
N$42  (via drill 0.35)
  Top 0.152: v8.43,48.51 11.48,48.51 12.24,49.28 16.97,49.28 18.49,47.75 v30.07,47.75 | v34.04,43.79 39.22,43.79 41.2,41.81 SYNC4.P3
  Bottom 0.152: v8.43,48.51 7.67,47.75 7.06,47.75 D4.C | v34.04,43.79 v30.07,47.75
N$43
  Top 0.152: SQ4.P3 41.2,13.92 43.94,11.18 43.94,8.59 42.57,7.21 42.27,7.21 42.11,7.06 41.96,7.06 41.35,6.45 SQ4.P2 41.2,6.45 32.21,6.45 30.53,4.78 30.38,4.93 29.16,4.93 19.86,14.22 19.86,14.68 18.34,16.21 17.73,16.21 9.96,23.98 9.96,41.05 6.91,44.09 6.45,44.09 4.93,45.62 4.62,45.62 RATED.P$1
  Bottom 0.152: IC_OSC.8 26.72,47.6 13.61,47.6 10.11,44.09 6.45,44.09 4.93,45.62 4.62,45.62 RATED.P$1
N$44
  Top 0.152: TRI4.P2 41.35,20.32 42.27,21.23 42.57,21.23 43.94,22.61 43.94,25.2 41.2,27.94 TRI4.P3
  Bottom 0.152: RATED.P$2 7.06,45.77 7.06,46.23 8.74,47.9 9.5,47.9 R4.2 9.65,48.06 15.44,48.06 16.82,49.43 | 16.82,49.43 17.88,48.36 21.84,48.36 22.45,48.97 26.72,48.97 IC_OSC.9 26.87,48.97 27.33,48.97 28.09,49.73 28.09,51.87 27.94,52.02 28.4,52.48 28.4,52.63 31.6,55.83 34.04,55.83 34.49,55.37 34.49,52.48 34.95,52.02 34.95,35.87 41.35,29.46 41.35,27.94 TRI4.P3 | 16.82,49.43 16.82,50.65 18.34,52.17 18.34,52.63 SWD.2
N$45
  Bottom 0.152: C8.1 21.54,50.04 19.71,50.04 19.41,50.34 19.1,50.04 18.49,50.04 SWD.3
N$46
  Bottom 0.152: C9.1 21.54,55.52 18.49,55.52 SWD.1
N$47
  Bottom 0.152: IC_PLL.11 52.17,48.97 53.54,48.97 54.76,50.19 54.76,58.42 55.22,58.88 55.22,59.64 RANGE.P$2
N$48
  Bottom 0.152: MODIN.P2 66.8,77.47 63.6,80.67 62.54,80.67 R5.2
N$49
  Bottom 0.152: IC_PLL.9 52.17,46.38 53.54,46.38 56.29,49.12 56.29,55.98 64.97,64.67 64.97,70.31 68.02,73.35 68.63,73.35 70.31,75.03 70.31,82.65 67.87,85.09 MODIN.P3
N$50
  Bottom 0.152: R13.1 96.52,72.59 98.5,74.57 98.5,75.18 J1.RING
N$51
  Bottom 0.152: R14.1 93.93,67.56 91.8,67.56 91.19,68.17 J1.TIP
N$52
  Bottom 0.152: C14.- 87.68,38 89.36,38 93.32,41.96 AMP-1-OUT.P3
N$53  (via drill 0.35)
  Top 0.152: v56.13,85.7 58.57,83.26 71.07,83.26 79.15,75.18 80.06,75.18 81.58,73.66 81.89,73.66 AMP2.P$2
  Bottom 0.152: v56.13,85.7 54.15,87.68 52.78,87.68 IC2.3
N$54
  Bottom 0.152: R18.1 54.3,90.88 56.29,90.88 C16.2
N$55  (via drill 0.35)
  Top 0.152: v55.52,87.22 55.37,87.07 55.37,85.24 68.02,72.59 68.63,72.59 79.76,61.47 84.94,61.47 86.92,59.49 v86.92,11.79
  Bottom 0.152: C16.1 57.96,90.73 57.96,88.9 IC2.5 56.44,88.9 55.52,87.99 v55.52,87.22 | v86.92,11.79 87.53,11.18 87.53,9.8 C17.+
N$56
  Bottom 0.152: R16.1 96.52,59.64 98.5,61.62 98.5,62.38 J2.RING
N$57
  Bottom 0.152: R17.1 93.93,56.59 92.1,56.59 91.19,55.68 J2.TIP
N$58  (via drill 0.35)
  Top 0.152: v92.71,55.22 79.91,68.02 79.91,72.29 79.45,72.75 79.45,73.51 AMP2.P$1
  Bottom 0.152: R16.2 96.52,55.07 94.08,55.07 R17.2 93.93,55.07 92.86,55.07 v92.71,55.22
N$59
  Bottom 0.152: C17.- 87.68,14.53 91.64,14.53 92.1,14.07 93.32,14.07 AMP-1-OUT1.P3
N$60
  Bottom 0.152: IC3.3 52.78,97.74 55.98,97.74 56.59,98.35 58.88,98.35 61.01,100.48 73.05,100.48 75.34,98.2 75.34,93.78 80.06,89.05 80.21,89.05 81.58,87.68 81.89,87.68 AMP3.P$2
N$61
  Bottom 0.152: R19.1 54.3,100.94 56.29,100.94 C19.2
N$62  (via drill 0.35)
  Top 0.152: v60.55,100.94 63.91,100.94 67.72,97.13 69.09,97.13 73.2,93.02 v73.2,87.53
  Bottom 0.152: IC3.5 57.96,99.11 57.96,100.94 C19.1 58.12,100.94 v60.55,100.94 | v73.2,87.53 73.2,53.24 86.61,39.83 86.61,36.02 87.38,35.26 88.59,35.26 88.9,34.95 88.9,31.45 86.31,28.85 86.31,25.2 87.68,23.82 87.68,22.45 C20.+
N$63
  Top 0.152: B.P2 81.89,6.45 77.62,6.45 67.87,16.21 67.26,16.21 56.74,26.72 56.74,28.55 55.22,30.07 54.76,30.07 42.72,42.11 42.72,44.09 41.2,45.62 BIN.P$2
N$64
  Top 0.152: B.P3 82.04,14.07 86,18.03 86,55.22 82.96,58.27 79.91,58.27 79.76,58.12 78.84,58.12 70.61,66.34 70.61,67.56 69.24,68.94 61.32,68.94 53.39,76.86 46.53,76.86 31.45,91.95 31.45,92.56 29.92,94.08 29.92,94.54 S7.2
N$65
  Bottom 0.152: R20.1 96.52,52.32 97.59,52.32 98.5,51.41 98.5,50.5 J3.RING
N$66
  Bottom 0.152: C20.- 87.68,27.18 91.49,27.18 92.1,27.79 93.17,27.79 93.32,27.94 AMP-1-OUT2.P3
N$67
  Bottom 0.152: C26.1 32.97,91.95 31.14,91.95 30.84,92.25 30.53,91.95 29.92,91.95 S7.3
N$68
  Bottom 0.152: C25.1 32.97,97.43 29.92,97.43 S7.1
N$69
  Bottom 0.152: Q1.1 99.42,89.2 99.42,93.93 R11.1
N$70
  Bottom 0.152: R11.2 97.43,94.08 97.43,95 93.47,98.96 MODE-IN.P3
N$71
  Bottom 0.152: Q2.1 99.42,80.97 99.42,85.7 R12.1
N$72
  Bottom 0.152: RATE-IN.P3 94.54,85.09 95.15,85.7 97.43,85.7 R12.2
N$73
  Bottom 0.152: 95.15,50.65 96.52,50.65 R20.2 | 95.15,50.65 94.08,50.65 R21.2 | 95.15,50.65 95.15,52.93 94.39,53.7 84.48,53.7 82.5,55.68 81.28,55.68 75.34,61.62 75.34,83.41 79.45,87.53 AMP3.P$1
N$74
  Bottom 0.152: R21.1 93.93,52.17 93.32,52.17 89.81,48.67 89.81,45.77 91.03,44.55 91.03,43.64 J3.TIP
N$78  (via drill 0.35)
  Top 0.152: SWB.2 18.34,80.52 17.73,80.52 12.39,75.18 8.89,75.18 7.37,73.66 7.06,73.66 RATEB.P$2 | 18.34,27.94 20.02,29.62 20.02,34.19 30.68,44.86 v30.68,51.41 26.87,55.22 v25.2,55.22 | 18.34,27.94 21.08,25.2 21.08,22.61 19.71,21.23 19.41,21.23 18.49,20.32 TRI2.P2 | 18.34,27.94 TRI2.P3
  Bottom 0.152: 10.57,62.54 10.11,62.08 9.65,62.08 R2.2 | 10.57,62.54 10.57,64.52 7.52,67.56 7.52,72.29 7.06,72.75 7.06,73.51 RATEB.P$2 | v30.68,51.41 30.68,51.87 31.45,52.63 32.82,52.63 IC_OSC.3 | 10.57,62.54 17.88,62.54 v25.2,55.22
N$79
  Top 0.152: 50.8,87.99 52.93,90.12 52.93,92.25 IC4.1 | 50.8,87.99 50.8,80.06 52.78,78.08 C27.+ | CN1.PWR1 38,96.52 46.53,87.99 50.8,87.99
N$87
  Bottom 0.152: IC_PLL.4 58.27,51.41 57.05,51.41 56.59,51.87 56.59,55.68 63.45,62.54 66.8,62.54 67.87,63.6 PLL.P2 67.87,63.45 66.95,64.36 66.65,64.36 65.28,65.73 65.28,68.33 67.26,70.31 67.26,70.46 67.87,71.07 PLL.P3
R
  Bottom 0.152: C22.2 33.12,65.73 33.12,67.72 C21.2 33.12,67.87 33.73,67.87 34.19,68.33 34.19,71.37 27.94,77.62 27.94,80.67 25.5,83.11 24.13,83.11 22.15,85.09 22,85.09 21.54,85.55 21.54,88.29 23.22,89.97 TO_TEST_GEN.7
RATE_BTN_1  (via drill 0.35)
  Top 0.152: v98.5,81.74 98.5,74.42 95,70.92 95,70.46 90.27,65.73 | 90.27,65.73 90.12,65.73 89.51,65.13 89.51,64.52 S9.B2 | v26.57,81.13 28.09,81.13 29.01,82.04 29.31,82.04 29.46,82.19 30.23,82.19 30.38,82.04 35.26,82.04 36.02,82.8 v36.78,82.8 | v60.1,83.87 67.11,83.87 67.41,83.57 71.22,83.57 79.3,75.49 84.94,75.49 87.99,72.44 87.99,68.02 90.27,65.73
  Bottom 0.152: v98.5,81.74 98.5,82.96 Q2.3 | v26.57,81.13 26.42,80.97 26.42,80.21 TO_TEST_GEN.2 | v36.78,82.8 51.41,82.8 52.48,83.87 v60.1,83.87
RATE_BTN_2  (via drill 0.35)
  Top 0.152: v97.43,77.01 97.43,73.81 94.69,71.07 94.69,70.61 93.32,69.24 89.81,69.24 89.51,68.94 S9.A2 89.36,68.94 88.9,69.39 88.9,71.98 85.09,75.79 79.45,75.79 68.63,86.61 67.41,86.61 65.58,84.78 v60.1,84.78 | v24.59,80.21 29.31,84.94 v34.65,84.94
  Bottom 0.152: v97.43,77.01 97.43,80.82 Q2.2 | v24.59,80.21 23.37,78.99 23.37,78.23 TO_TEST_GEN.1 | v34.65,84.94 50.5,84.94 51.26,84.18 59.49,84.18 v60.1,84.78
VCC
  Top 0.152: C28.+ 52.93,86.92 54.3,88.29 54.46,88.29 57.51,91.34 57.51,92.25 IC4.2 57.51,92.41 55.68,92.41 50.19,97.89 50.19,98.04 49.58,98.65 49.58,98.96 GNDP1.1
  Bottom 0.152: C1.2 26.72,56.9 26.72,55.37 IC_OSC.14 26.87,55.22 30.53,55.22 31.45,56.13 46.99,56.13 48.36,54.76 48.82,54.76 C10.2 48.97,54.92 50.5,54.92 50.65,55.07 | 50.65,55.07 50.8,55.22 52.17,55.22 IC_PLL.16 | 60.71,87.68 57.96,87.68 IC2.6 | 60.71,78.84 60.71,80.52 R5.1 60.71,80.67 60.71,87.53 C15.1 60.71,87.68 | 59.49,78.84 59.33,78.84 59.18,78.69 57.96,78.69 IC1.6 | 59.49,78.84 60.71,78.84 | 60.71,78.84 C18.1 | 60.71,87.68 60.71,97.74 C12.1 60.71,97.89 59.33,97.89 59.18,97.74 57.96,97.74 IC3.6 57.81,97.74 56.44,97.74 54.3,95.61 54.3,94.69 54,94.39 51.26,94.39 50.19,95.45 50.19,98.04 49.58,98.65 49.58,98.96 GNDP1.1 49.28,98.81 40.28,98.81 40.13,98.96 29.16,98.96 26.42,96.21 TO_TEST_GEN.10 | 50.65,55.07 50.5,55.22 50.5,62.38 59.49,71.37 59.49,78.84
(copper drawn outside any net)
  shapes: Top area x2